# Altium project Voice.PrjPcb
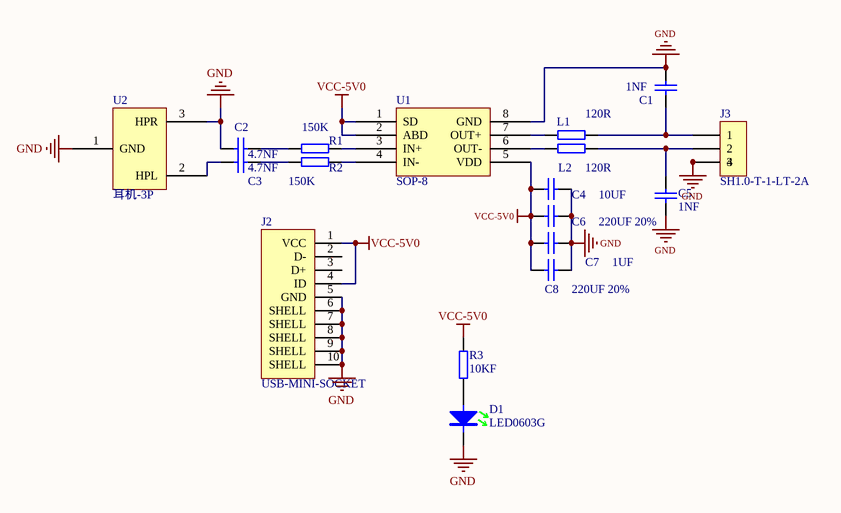
[diagram p0: Voice.SchDoc]
1 sheet, 18 parts. Net scope: global (net labels, ports and power ports of the same name join across sheets).
Board file: voice.PcbDoc

## Sheet Voice.SchDoc
size A4

### Parts
C1  1NF  [C0402]
C2  4.7NF  [C0603]
C3  4.7NF  [C0603]
C4  10UF  [C0603]
C5  1NF  [C0402]
C6  220UF 20%  [C1206]
C7  1UF  [C0402]
C8  220UF 20%  [C1206]
D1  LED0603G  [D-LED0603G]
J2  USB-MINI-SOCKET  [MICRO-USB - 5.9]
J3  SH1.0-T-1-LT-2A  [J-SH1.0-T-1-LT-2A]
L1  120R  [R0603]
L2  120R  [R0603]
R1  150K  [R0603]
R2  150K  [R0603]
R3  10KF  [R0603]
U1  SOP-8  [SOP-8]
U2  耳机-3P  [耳机]

### Nets
GND: C1.2 C2.1 C4.2 C5.2 C6.1 C7.1 C8.1 D1.2 J2.5(GND) J2.6(SHELL) J2.7(SHELL) J2.8(SHELL) J2.9(SHELL) J2.10(SHELL) J3.3 J3.4 U1.8(GND) U2.1(GND) U2.3(HPR)
VCC-5V0: C4.1 C6.2 C7.2 C8.2 J2.1(VCC) J2.4(ID) R3.2 U1.1(SD) U1.2(ABD) U1.5(VDD)
NetC1_1: C1.1 J3.1 L1.1
NetC2_2: C2.2 R1.1
NetC3_1: C3.1 U2.2(HPL)
NetC3_2: C3.2 R2.1
NetC5_1: C5.1 J3.2 L2.1
NetD1_1: D1.1 R3.1
NetL1_2: L1.2 U1.7(OUT+)
NetL2_2: L2.2 U1.6(OUT-)
NetR1_2: R1.2 U1.3(IN+)
NetR2_2: R2.2 U1.4(IN-)

Not connected (* = marked no-connect by the designer): J2 2(D-) 3(D+)

### Library data of the parts
C1 C5 = C0402X7R-220J10V: 贴片电容-陶瓷; 规格型号: 22pF±5%_10V_X7R_C0402; 生产商: 风华 三星; 供应商: *; 备注: *
C2-C4 = C0603X7R-330J25V: 贴片电容-陶瓷; 规格型号: 33pF±5%_25V_X7R_C0603; 生产商: 风华 三星; 供应商: *; 备注: *
C6 C8 = C1206-A型 极性电容: C 1206钽电容 --220UF 10V 3216 A型 有极性电容 3.2mm X 1.6mm; 参数: C 1206钽电容 --220UF 20% 10V 3216 A型 有极性 白色为正 电容 3.2mm X 1.6mm
C7 = C0402X7R-105J10V: 贴片电容-陶瓷; 规格型号: 1uF±J%_10V_X7R_C0402; 生产商: 风华 三星; 供应商: *; 备注: *
D1 = DLED-0603-G: 贴片二极管-LED; 规格型号: 0603-GREEN; 货品编码: 无样品无编码; 生产商: *; 供应商: *; 备注: *
J2 = J-USB-MINI-SOCKET: USB-A卧式插座; 供应商: *; 备注: *
J3 = SH1.0-T-1-LT-2A: 接插件-SH1.0-T-1-LT-2A; 规格型号: 1.0m立式贴片插座2P/SH1.0-T-1-LT-2A; 供应商: *; 备注: *
L1 L2 = R0603-47KF: 贴片电阻-通用; 生产商: 厚声 国巨; 规格型号: 47K±1%_1/10W_±200ppm_R0603; 货品编码: 无样品无编码; 备注: *; 供应商: *
R1-R3 = R0603-10KF: 贴片电阻-通用; 生产商: 厚声 国巨; 规格型号: 10K±1%_1/10W_±200ppm_R0603; 备注: *; 供应商: *
U1 = CS8508E